# EAGLE design untitled (EAGLE 9.6.2)
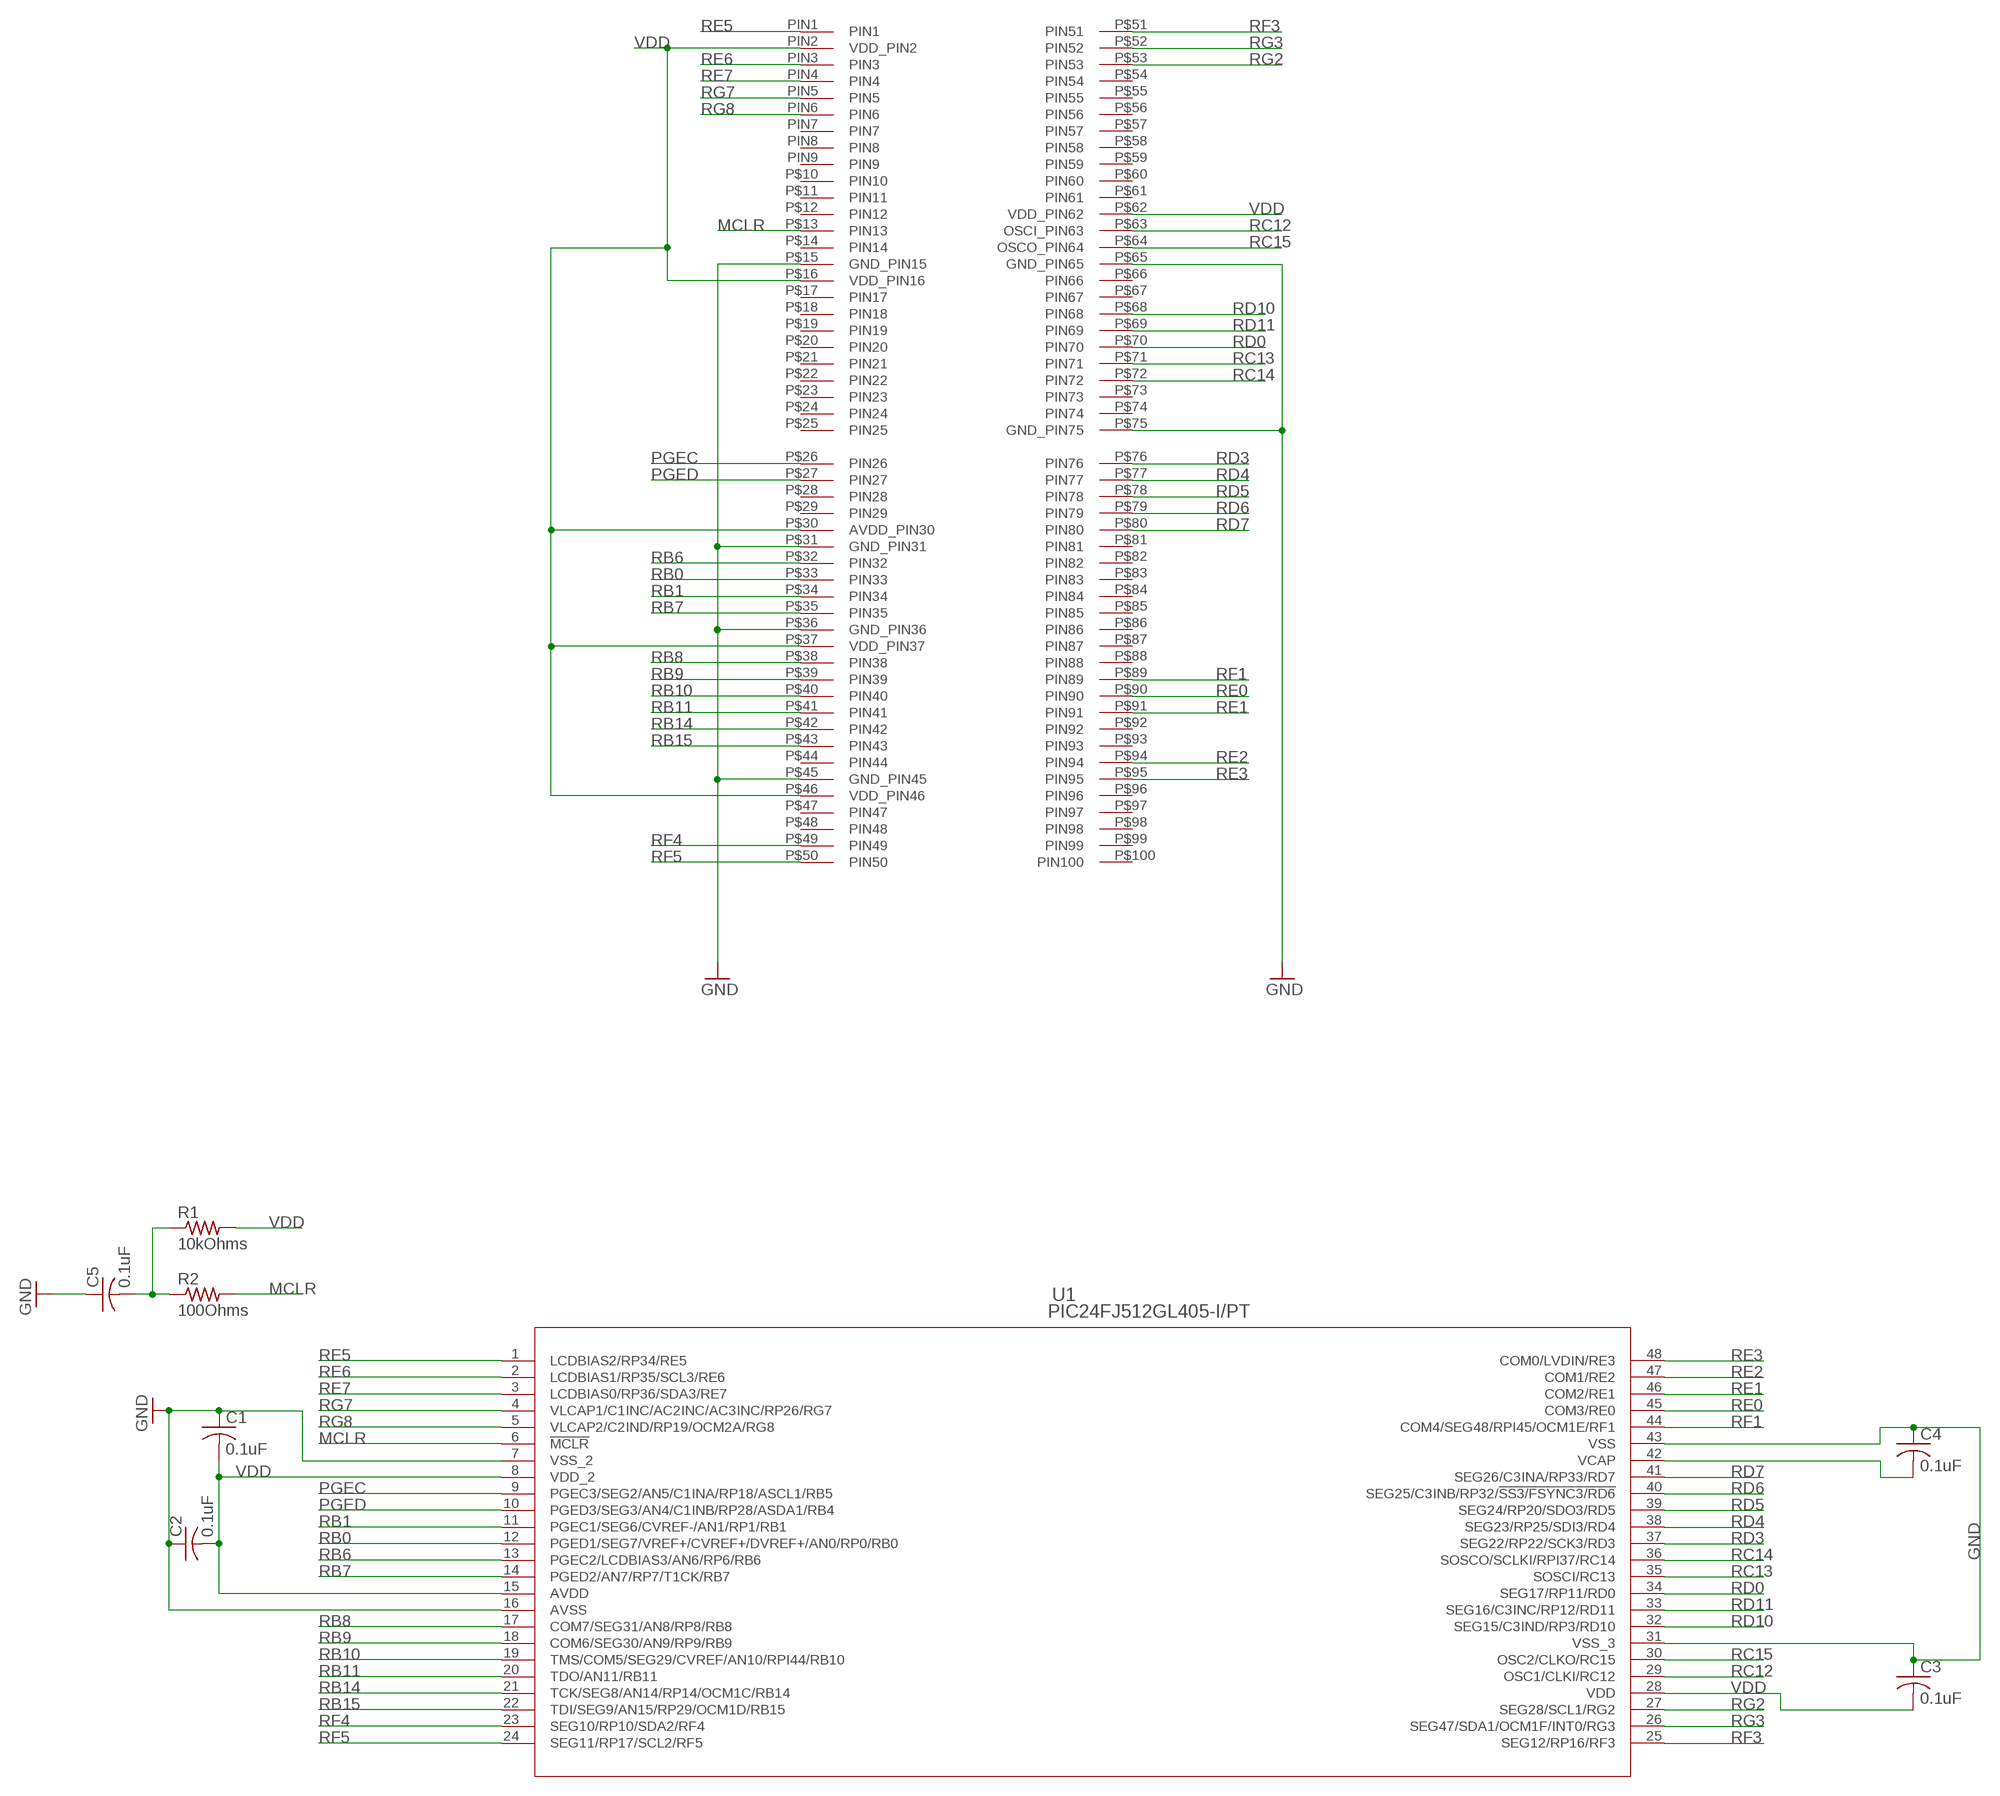
[diagram p0: schematic, sheet 1]

## Parts
C1  0.1uF  C-USC0603  [C0603]
C2  0.1uF  C-USC0603  [C0603]
C3  0.1uF  C-USC0603  [C0603]
C4  0.1uF  C-USC0603  [C0603]
C5  0.1uF  C-USC0603  [C0603]
R1  10kOhms  R-US_R0603  [R0603]
R2  100Ohms  R-US_R0603  [R0603]
U1  PIC24FJ512GL405-I/PT  [TQFP48_PT_MCH]
U$1  PIC_24_PIM_100  [PIC_PIM_100]

## Nets
GND: C1.1 C2.1 C3.1 C4.1 C5.1 U1.7(VSS_2) U1.16(AVSS) U1.31(VSS_3) U1.43(VSS) U$1.P$15(GND_PIN15) U$1.P$31(GND_PIN31) U$1.P$36(GND_PIN36) U$1.P$45(GND_PIN45) U$1.P$65(GND_PIN65) U$1.P$75(GND_PIN75)
MCLR: R2.2 U1.6(!MCLR) U$1.P$13(PIN13)
N$4: C5.2 R1.1 R2.1
N$5: C4.2 U1.42(VCAP)
PGEC: U1.9(PGEC3/SEG2/AN5/C1INA/RP18/ASCL1/RB5) U$1.P$26(PIN26)
PGED: U1.10(PGED3/SEG3/AN4/C1INB/RP28/ASDA1/RB4) U$1.P$27(PIN27)
RB0: U1.12(PGED1/SEG7/VREF+/CVREF+/DVREF+/AN0/RP0/RB0) U$1.P$33(PIN33)
RB1: U1.11(PGEC1/SEG6/CVREF-/AN1/RP1/RB1) U$1.P$34(PIN34)
RB6: U1.13(PGEC2/LCDBIAS3/AN6/RP6/RB6) U$1.P$32(PIN32)
RB7: U1.14(PGED2/AN7/RP7/T1CK/RB7) U$1.P$35(PIN35)
RB8: U1.17(COM7/SEG31/AN8/RP8/RB8) U$1.P$38(PIN38)
RB9: U1.18(COM6/SEG30/AN9/RP9/RB9) U$1.P$39(PIN39)
RB10: U1.19(TMS/COM5/SEG29/CVREF/AN10/RPI44/RB10) U$1.P$40(PIN40)
RB11: U1.20(TDO/AN11/RB11) U$1.P$41(PIN41)
RB14: U1.21(TCK/SEG8/AN14/RP14/OCM1C/RB14) U$1.P$42(PIN42)
RB15: U1.22(TDI/SEG9/AN15/RP29/OCM1D/RB15) U$1.P$43(PIN43)
RC12: U1.29(OSC1/CLKI/RC12) U$1.P$63(OSCI_PIN63)
RC13: U1.35(SOSCI/RC13) U$1.P$71(PIN71)
RC14: U1.36(SOSCO/SCLKI/RPI37/RC14) U$1.P$72(PIN72)
RC15: U1.30(OSC2/CLKO/RC15) U$1.P$64(OSCO_PIN64)
RD0: U1.34(SEG17/RP11/RD0) U$1.P$70(PIN70)
RD3: U1.37(SEG22/RP22/SCK3/RD3) U$1.P$76(PIN76)
RD4: U1.38(SEG23/RP25/SDI3/RD4) U$1.P$77(PIN77)
RD5: U1.39(SEG24/RP20/SDO3/RD5) U$1.P$78(PIN78)
RD6: U1.40(SEG25/C3INB/RP32/!SS3/FSYNC3/RD6) U$1.P$79(PIN79)
RD7: U1.41(SEG26/C3INA/RP33/RD7) U$1.P$80(PIN80)
RD10: U1.32(SEG15/C3IND/RP3/RD10) U$1.P$68(PIN68)
RD11: U1.33(SEG16/C3INC/RP12/RD11) U$1.P$69(PIN69)
RE0: U1.45(COM3/RE0) U$1.P$90(PIN90)
RE1: U1.46(COM2/RE1) U$1.P$91(PIN91)
RE2: U1.47(COM1/RE2) U$1.P$94(PIN94)
RE3: U1.48(COM0/LVDIN/RE3) U$1.P$95(PIN95)
RE5: U1.1(LCDBIAS2/RP34/RE5) U$1.PIN1
RE6: U1.2(LCDBIAS1/RP35/SCL3/RE6) U$1.PIN3
RE7: U1.3(LCDBIAS0/RP36/SDA3/RE7) U$1.PIN4
RF1: U1.44(COM4/SEG48/RPI45/OCM1E/RF1) U$1.P$89(PIN89)
RF3: U1.25(SEG12/RP16/RF3) U$1.P$51(PIN51)
RF4: U1.23(SEG10/RP10/SDA2/RF4) U$1.P$49(PIN49)
RF5: U1.24(SEG11/RP17/SCL2/RF5) U$1.P$50(PIN50)
RG2: U1.27(SEG28/SCL1/RG2) U$1.P$53(PIN53)
RG3: U1.26(SEG47/SDA1/OCM1F/INT0/RG3) U$1.P$52(PIN52)
RG7: U1.4(VLCAP1/C1INC/AC2INC/AC3INC/RP26/RG7) U$1.PIN5
RG8: U1.5(VLCAP2/C2IND/RP19/OCM2A/RG8) U$1.PIN6
VDD: C1.2 C2.2 C3.2 R1.2 U1.8(VDD_2) U1.15(AVDD) U1.28(VDD) U$1.P$16(VDD_PIN16) U$1.P$30(AVDD_PIN30) U$1.P$37(VDD_PIN37) U$1.P$46(VDD_PIN46) U$1.P$62(VDD_PIN62) U$1.PIN2(VDD_PIN2)
Unconnected: U$1.P$10(PIN10) U$1.P$11(PIN11) U$1.P$12(PIN12) U$1.P$14(PIN14) U$1.P$17(PIN17) U$1.P$18(PIN18) U$1.P$19(PIN19) U$1.P$20(PIN20) U$1.P$21(PIN21) U$1.P$22(PIN22) U$1.P$23(PIN23) U$1.P$24(PIN24) U$1.P$25(PIN25) U$1.P$28(PIN28) U$1.P$29(PIN29) U$1.P$44(PIN44) U$1.P$47(PIN47) U$1.P$48(PIN48) U$1.P$54(PIN54) U$1.P$55(PIN55) U$1.P$56(PIN56) U$1.P$57(PIN57) U$1.P$58(PIN58) U$1.P$59(PIN59) U$1.P$60(PIN60) U$1.P$61(PIN61) U$1.P$66(PIN66) U$1.P$67(PIN67) U$1.P$73(PIN73) U$1.P$74(PIN74) U$1.P$81(PIN81) U$1.P$82(PIN82) U$1.P$83(PIN83) U$1.P$84(PIN84) U$1.P$85(PIN85) U$1.P$86(PIN86) U$1.P$87(PIN87) U$1.P$88(PIN88) U$1.P$92(PIN92) U$1.P$93(PIN93) U$1.P$96(PIN96) U$1.P$97(PIN97) U$1.P$98(PIN98) U$1.P$99(PIN99) U$1.P$100(PIN100) U$1.PIN7 U$1.PIN8 U$1.PIN9

## Library data of the parts
C1-C5 = rcl:C-US: CAPACITOR, American symbol; SPICEPREFIX: C
R1 R2 = rcl:R-US_: RESISTOR, American symbol; SPICEPREFIX: R
U1 = PIC24FJ512GL405_UL:PIC24FJ512GL405-I/PT; COPYRIGHT: Copyright (C) 2023 Ultra Librarian. All rights reserved.; MANUFACTURER_PART_NUMBER: PIC24FJ512GL405-I/PT; MFR_NAME: Microchip
U$1 = PIC_PIM:PIC_24_PIM_100

## Board
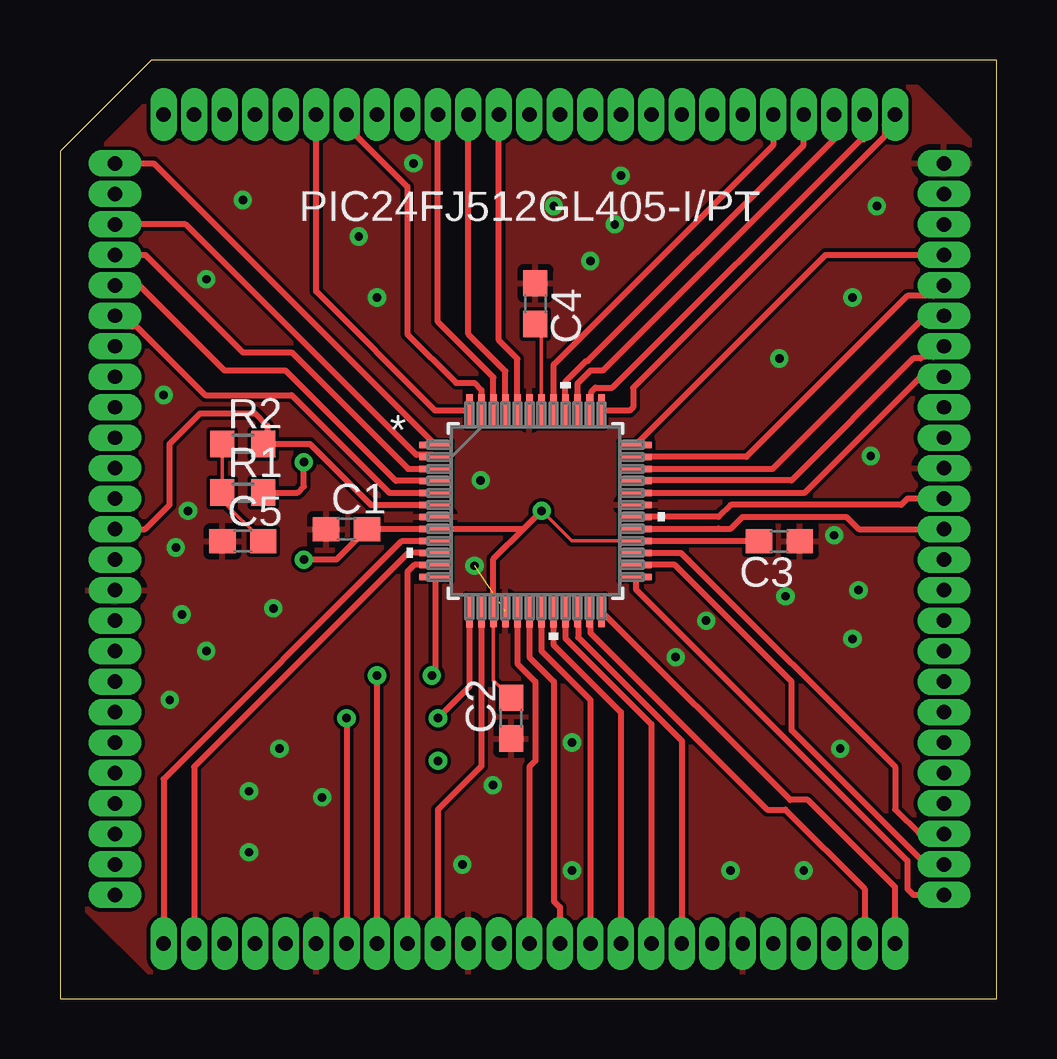
[diagram p1: board, top side]
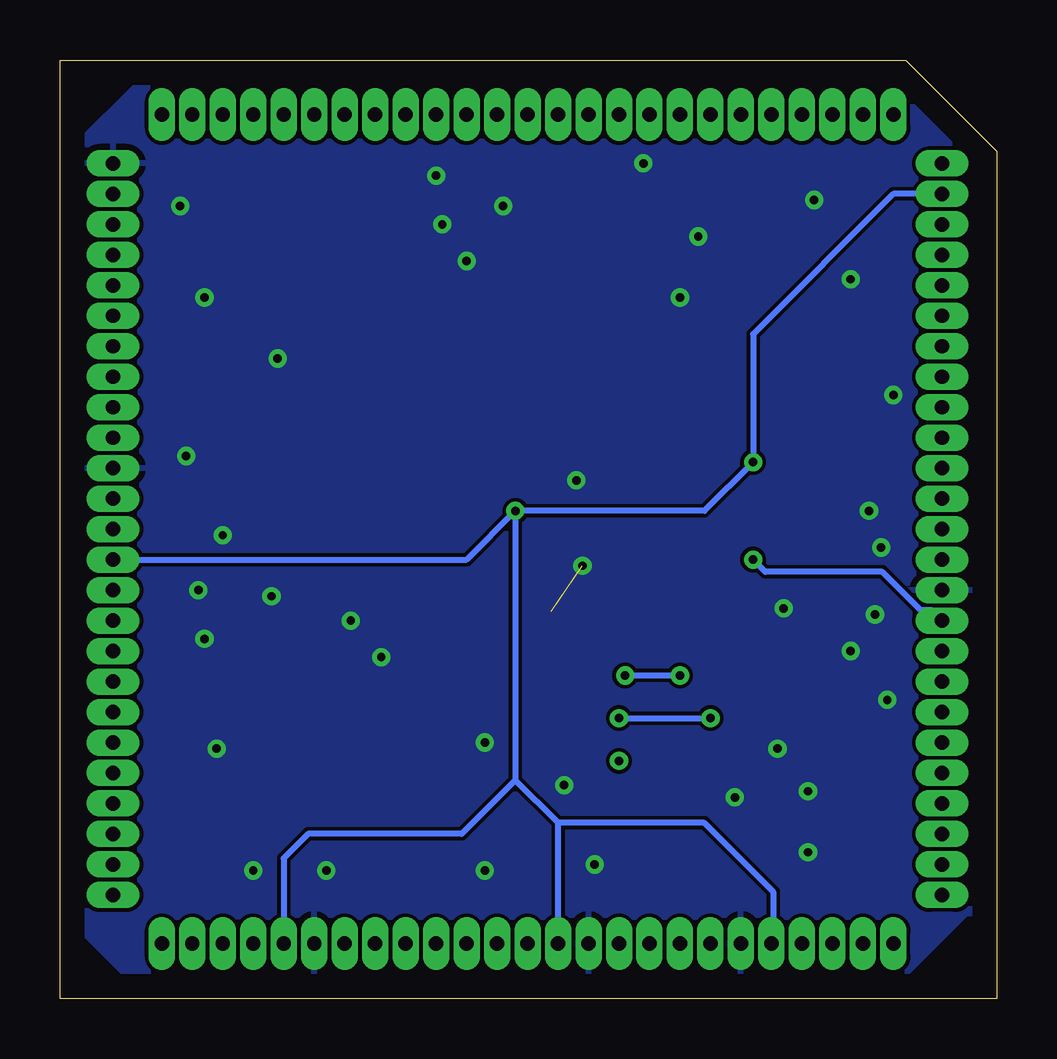
[diagram p2: board, bottom side, seen from below]

Size 39.04 x 39.11 mm. Coordinates in mm from the lower left corner, seen from the top.
Outline: 0,0 39.04,0 39.04,39.11 3.8,39.11 0,35.31 0,0
Copper layers (1*16): Top 0.035mm / dielectric 1.5mm / Bottom 0.035mm
Design rules "default": minimum track width 6mil, minimum drill 0.35mm, track to track 6mil, track to pad 6mil, pad to pad 6mil, via to via 6mil, smd to smd 6mil, copper to edge 40mil, drill to drill 6mil, minimum pad ring 10mil, minimum via ring 8mil, stop-mask expansion 4mil, vias tented up to drill 0mil, thermal gap 10mil

### Footprints (pad centres in the part's own frame; a part is rotated, then mirrored left to right if it is on the bottom)
C0603 = smd 1.1 x 1: 1 -0.85,0; 2 0.85,0
R0603 = smd 1 x 1.1: 1 -0.85,0; 2 0.85,0
TQFP48_PT_MCH = smd 1.346 x 0.279: 1 -4.178,2.75; 2 -4.178,2.25; 3 -4.178,1.75; 4 -4.178,1.25; 5 -4.178,0.75; 6 -4.178,0.25; 7 -4.178,-0.25; 8 -4.178,-0.75; 9 -4.178,-1.25; 10 -4.178,-1.75; 11 -4.178,-2.25; 12 -4.178,-2.75; 25 4.178,-2.75; 26 4.178,-2.25; 27 4.178,-1.75; 28 4.178,-1.25; 29 4.178,-0.75; 30 4.178,-0.25; 31 4.178,0.25; 32 4.178,0.75; 33 4.178,1.25; 34 4.178,1.75; 35 4.178,2.25; 36 4.178,2.75 | smd 0.279 x 1.346: 13 -2.75,-4.178; 14 -2.25,-4.178; 15 -1.75,-4.178; 16 -1.25,-4.178; 17 -0.75,-4.178; 18 -0.25,-4.178; 19 0.25,-4.178; 20 0.75,-4.178; 21 1.25,-4.178; 22 1.75,-4.178; 23 2.25,-4.178; 24 2.75,-4.178; 37 2.75,4.178; 38 2.25,4.178; 39 1.75,4.178; 40 1.25,4.178; 41 0.75,4.178; 42 0.25,4.178; 43 -0.25,4.178; 44 -0.75,4.178; 45 -1.25,4.178; 46 -1.75,4.178; 47 -2.25,4.178; 48 -2.75,4.178
PIC_PIM_100 = drill 0.6 pad 0.813 long: P$10 0,-11.43; P$11 0,-12.7; P$12 0,-13.97; P$13 0,-15.24; P$14 0,-16.51; P$15 0,-17.78; P$16 0,-19.05; P$17 0,-20.32; P$18 0,-21.59; P$19 0,-22.86; P$20 0,-24.13; P$21 0,-25.4; P$22 0,-26.67; P$23 0,-27.94; P$24 0,-29.21; P$25 0,-30.48; P$26 2.032,-32.512; P$27 3.302,-32.512; P$28 4.572,-32.512; P$29 5.842,-32.512; P$30 7.112,-32.512; P$31 8.382,-32.512; P$32 9.652,-32.512; P$33 10.922,-32.512; P$34 12.192,-32.512; P$35 13.462,-32.512; P$36 14.732,-32.512; P$37 16.002,-32.512; P$38 17.272,-32.512; P$39 18.542,-32.512; P$40 19.812,-32.512; P$41 21.082,-32.512; P$42 22.352,-32.512; P$43 23.622,-32.512; P$44 24.892,-32.512; P$45 26.162,-32.512; P$46 27.432,-32.512; P$47 28.702,-32.512; P$48 29.972,-32.512; P$49 31.242,-32.512; P$50 32.512,-32.512; P$51 34.544,-30.48; P$52 34.544,-29.21; P$53 34.544,-27.94; P$54 34.544,-26.67; P$55 34.544,-25.4; P$56 34.544,-24.13; P$57 34.544,-22.86; P$58 34.544,-21.59; P$59 34.544,-20.32; P$60 34.544,-19.05; P$61 34.544,-17.78; P$62 34.544,-16.51; P$63 34.544,-15.24; P$64 34.544,-13.97; P$65 34.544,-12.7; P$66 34.544,-11.43; P$67 34.544,-10.16; P$68 34.544,-8.89; P$69 34.544,-7.62; P$70 34.544,-6.35; P$71 34.544,-5.08; P$72 34.544,-3.81; P$73 34.544,-2.54; P$74 34.544,-1.27; P$75 34.544,0; P$76 32.512,2.032; P$77 31.242,2.032; P$78 29.972,2.032; P$79 28.702,2.032; P$80 27.432,2.032; P$81 26.162,2.032; P$82 24.892,2.032; P$83 23.622,2.032; P$84 22.352,2.032; P$85 21.082,2.032; P$86 19.812,2.032; P$87 18.542,2.032; P$88 17.272,2.032; P$89 16.002,2.032; P$90 14.732,2.032; P$91 13.462,2.032; P$92 12.192,2.032; P$93 10.922,2.032; P$94 9.652,2.032; P$95 8.382,2.032; P$96 7.112,2.032; P$97 5.842,2.032; P$98 4.572,2.032; P$99 3.302,2.032; P$100 2.032,2.032; PIN1 0,0; PIN2 0,-1.27; PIN3 0,-2.54; PIN4 0,-3.81; PIN5 0,-5.08; PIN6 0,-6.35; PIN7 0,-7.62; PIN8 0,-8.89; PIN9 0,-10.16

### Placement (x,y rotation side)
C1  11.94,19.56 0 top
C2  18.8,11.68 90 top
C3  29.97,19.05 180 top
C4  19.81,28.96 270 top
C5  7.62,19.05 0 top
R1  7.62,21.08 0 top
R2  7.62,23.11 0 top
U1  19.81,20.32 0 top
U$1  2.29,34.8 0 top

### Tracks (layer width: path | path; a pad name or v marks a point on that pad's centre or on a via)
GND  (via drill 0.35)  (1 unrouted)
  other vias: 18.03,8.89 16.76,5.59 8.89,16.26 6.1,14.48 5.08,16 4.57,12.45 33.02,14.99 33.27,17.02 30.23,16.76 32.26,19.3 33.78,22.61 9.14,10.41 7.87,8.64 7.87,6.1 10.92,8.38 25.65,14.22 26.92,15.75 23.37,34.29 20.57,33.02 23.11,32.26 22.1,30.73 34.04,33.02 33.02,29.21 29.97,26.67 4.32,25.15 5.33,20.32 4.83,18.8 7.62,33.27 12.45,31.75 13.21,29.21 17.53,21.59 17.27,18.03 6.1,29.97 14.73,34.8 32.51,10.41 30.99,5.33 27.94,5.33 21.34,10.67 21.34,5.33
  pour Top: 1.02,35.05 4.06,38.1 35.56,38.1 35.81,37.85 38.35,35.31 38.35,35.05 38.35,3.05 36.07,0.76 4.06,0.76 1.02,3.81
  pour Bottom: 0.76,35.05 4.06,38.35 35.56,38.35 38.61,35.31 38.61,3.3 36.07,0.76 4.06,0.76 1.27,3.56 0.76,3.56
MCLR
  Top 0.152: 8.64,23.11 R2.2
  Top 0.254: 8.47,23.37 R2.2 10.41,23.11 12.96,20.57 U1.6 | U$1.P$13 3.56,19.56 4.57,20.57 4.57,23.11 5.84,24.38 8.13,24.38 8.64,23.88 8.64,23.11
N$4
  Top 0.152: R2.1 R1.1 6.77,20.75 C5.2
N$5
  Top 0.152: U1.42 20.06,27.86 C4.2
N$18  (via drill 0.35)
  other vias: 15.75,9.91
PGEC
  Top 0.254: U1.9 15.61,19.05 14.22,19.05 4.32,9.14 U$1.P$26
PGED
  Top 0.254: U1.10 14.51,18.57 5.59,9.65 U$1.P$27
RB0  (via drill 0.35)
  Top 0.254: U1.12 15.63,13.6 v15.49,13.46 | v13.21,13.46 U$1.P$33
  Bottom 0.254: v15.49,13.46 v13.21,13.46
RB1
  Top 0.254: U1.11 14.77,18.07 14.48,17.78 U$1.P$34
RB6  (via drill 0.35)
  Top 0.254: U1.13 17.06,13 v15.75,11.68 | v11.94,11.68 U$1.P$32
  Bottom 0.254: v15.75,11.68 v11.94,11.68
RB7
  Top 0.254: U1.14 17.56,9.69 15.75,7.87 U$1.P$35
RB8
  Top 0.254: U1.17 19.06,13.96 19.81,13.21 19.81,9.91 19.56,9.65 U$1.P$38
RB9
  Top 0.254: U1.18 19.56,14.48 19.56,14.22 20.57,13.21 20.57,4.06 20.83,3.81 U$1.P$39
RB10
  Top 0.254: U1.19 20.06,14.48 22.1,12.45 U$1.P$40
RB11
  Top 0.254: U1.20 20.56,14.74 23.37,11.94 U$1.P$41
RB14
  Top 0.254: U1.21 21.06,15.01 24.64,11.43 U$1.P$42
RB15
  Top 0.254: U1.22 21.59,16.11 21.59,15.05 25.91,10.73 U$1.P$43
RC12
  Top 0.254: U1.29 27.43,19.57 27.44,19.57 27.96,19.57 28.45,20.07 32.77,20.07 33.27,19.56 U$1.P$63
RC13
  Top 0.254: U$1.P$71 36.39,29.28 35.31,29.28 28.6,22.57 U1.35
RC14
  Top 0.254: U1.36 31.91,30.99 U$1.P$72
RC15
  Top 0.254: U$1.P$64 35.31,20.83 35.05,20.57 27.94,20.57 27.43,20.07 U1.30
RD0
  Top 0.254: U1.34 29.69,22.07 36.07,28.45 U$1.P$70
RD3
  Top 0.254: U$1.P$76 34.36,36.39 34.36,35.93 23.88,25.45 23.88,24.64 23.74,24.5 U1.37
RD4
  Top 0.254: U1.38 22.14,24.58 22.14,25.29 22.31,25.45 23.02,25.45 33.38,35.81 33.53,35.81 U$1.P$77
RD5
  Top 0.254: U$1.P$78 32.26,35.81 22.61,26.16 22.1,26.16 21.56,25.63 U1.39
RD6
  Top 0.254: U1.40 21.06,25.7 21.93,26.57 22,26.57 30.99,35.56 U$1.P$79
RD7
  Top 0.254: U$1.P$80 29.72,35.56 20.59,26.43 20.59,26.42 20.56,26.39 U1.41
RD10
  Top 0.254: U1.32 24,21.08 31.04,21.08 35.87,25.91 U$1.P$68
RD11
  Top 0.254: U$1.P$69 36.39,26.74 35.93,26.74 35.86,26.67 35.56,26.67 30.48,21.59 24.01,21.59 U1.33
RE0
  Top 0.254: U1.45 18.56,26.14 17.02,27.69 U$1.P$90
RE1
  Top 0.254: U1.46 18.06,25.88 15.75,28.19 U$1.P$91
RE2
  Top 0.254: U$1.P$94 12.38,36.39 12.38,35.93 14.48,33.83 14.48,27.69 16.51,25.65 17.27,25.65 17.56,25.36 U1.47
RE3
  Top 0.254: U1.48 15.63,24.5 10.67,29.46 U$1.P$95
RE5
  Top 0.254: U$1.PIN1 3.91,34.8 U1.1
RE6
  Top 0.254: U1.2 15.55,22.65 14.85,22.65 5.24,32.26 U$1.PIN3
RE7
  Top 0.254: U$1.PIN4 3.56,30.99 7.62,26.92 9.65,26.92 14.51,22.07 U1.3
RF1
  Top 0.254: U1.44 19.06,26.66 18.29,27.43 U$1.P$89
RF3
  Top 0.254: U1.25 23.99,17.06 35.31,5.75 35.31,4.57 35.56,4.32 U$1.P$51
RF4
  Top 0.254: U1.23 22.1,16.11 22.1,15.24 29.46,7.87 30.23,7.87 33.53,4.57 U$1.P$49
RF5
  Top 0.254: U1.24 30.42,8.28 31.16,8.28 34.8,4.64 U$1.P$50
RG2
  Top 0.254: U1.27 25.87,18.57 26.17,18.27 26.18,18.27 34.8,9.65 34.8,7.87 35.81,6.86 U$1.P$53
RG3
  Top 0.254: U$1.P$52 36.07,5.59 30.48,11.18 30.48,13.21 25.62,18.07 U1.26
RG7
  Top 0.254: U1.4 13.99,21.57 9.4,26.16 6.86,26.16 3.3,29.72 U$1.PIN5
RG8
  Top 0.254: U$1.PIN6 2.72,28.01 3.19,28.01 6.05,25.15 9.65,25.15 13.73,21.07 U1.5
VDD  (via drill 0.35)
  Top 0.152: 29.1,19.07 C3.2 | U1.15 18.06,13.27 C2.2 | v20.07,20.32 21.32,19.07 U1.28
  Top 0.254: 19.32,19.57 U1.8 15.62,19.56 C1.2 11.52,18.29 v10.16,18.29 | 19.32,19.57 v20.07,20.32 | U1.15 18.06,18.32 19.32,19.57 | R1.2 9.91,21.08 10.16,21.34 v10.16,22.35 | U1.28 29.1,19.07
  Bottom 0.254: U$1.PIN2 4.32,33.53 10.16,27.69 v10.16,22.35 12.19,20.32 v20.07,20.32 | U$1.P$37 18.29,7.32 | 20.07,9.1 18.29,7.32 | v20.07,20.32 20.07,9.1 | 20.07,9.1 22.31,6.86 28.7,6.86 29.72,5.84 U$1.P$46 | U$1.P$30 9.33,2.36 9.33,4.46 12.19,7.32 18.29,7.32 | U$1.P$62 22.1,18.29 v20.07,20.32 | U$1.P$16 2.72,16.18 3.19,16.18 4.78,17.78 9.65,17.78 v10.16,18.29